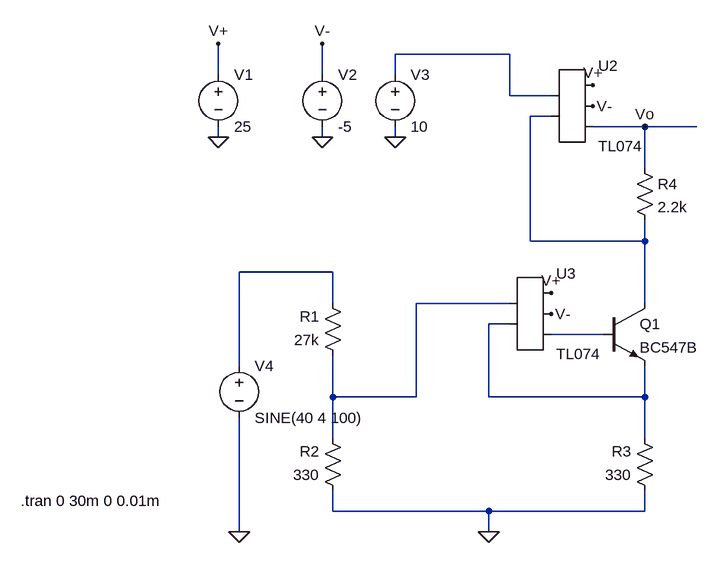
[diagram p0: schematic Actividad_Realimentacion.asc]
Actividad_Realimentacion.asc, the LTspice schematic file:
Version 4
SHEET 1 1040 680
WIRE 80 -96 -96 -96
WIRE -368 -64 -368 -112
WIRE -208 -64 -208 -112
WIRE -96 -64 -96 -96
WIRE 80 -32 80 -96
WIRE 144 -32 80 -32
WIRE 144 0 112 0
WIRE 288 16 208 16
WIRE 368 16 288 16
WIRE -368 32 -368 16
WIRE -208 32 -208 16
WIRE -96 32 -96 16
WIRE 288 80 288 16
WIRE 112 192 112 0
WIRE 288 192 288 160
WIRE 288 192 112 192
WIRE -192 240 -336 240
WIRE -192 288 -192 240
WIRE 80 288 -64 288
WIRE 288 288 288 192
WIRE 80 320 48 320
WIRE 224 336 144 336
WIRE -336 384 -336 240
WIRE -192 432 -192 368
WIRE -64 432 -64 288
WIRE -64 432 -192 432
WIRE 48 432 48 320
WIRE 288 432 288 384
WIRE 288 432 48 432
WIRE -192 496 -192 432
WIRE 288 496 288 432
WIRE -192 608 -192 576
WIRE 48 608 -192 608
WIRE 288 608 288 576
WIRE 288 608 48 608
WIRE -336 640 -336 464
WIRE 48 640 48 608
FLAG -368 32 0
FLAG -208 32 0
FLAG -368 -112 V+
FLAG -208 -112 V-
FLAG 144 304 V-
FLAG 144 272 V+
FLAG -96 32 0
FLAG 48 640 0
FLAG -336 640 0
FLAG 208 -48 V+
FLAG 208 -16 V-
FLAG 288 16 Vo
SYMBOL npn 224 288 R0
SYMATTR InstName Q1
SYMATTR Value BC547B
SYMBOL res -176 384 R180
WINDOW 0 36 76 Left 2
WINDOW 3 36 40 Left 2
SYMATTR InstName R1
SYMATTR Value 27k
SYMBOL res -176 592 R180
WINDOW 0 36 76 Left 2
WINDOW 3 36 40 Left 2
SYMATTR InstName R2
SYMATTR Value 330
SYMBOL voltage -368 -80 R0
WINDOW 123 0 0 Left 0
WINDOW 39 0 0 Left 0
SYMATTR InstName V1
SYMATTR Value 25
SYMBOL voltage -208 -80 R0
WINDOW 123 0 0 Left 0
WINDOW 39 0 0 Left 0
SYMATTR InstName V2
SYMATTR Value -5
SYMBOL AutoGenerated/TL074 112 304 R0
SYMATTR InstName U3
SYMBOL AutoGenerated/TL074 176 -16 R0
SYMATTR InstName U2
SYMBOL res 272 64 R0
SYMATTR InstName R4
SYMATTR Value 2.2k
SYMBOL voltage -96 -80 R0
WINDOW 123 0 0 Left 0
WINDOW 39 0 0 Left 0
SYMATTR InstName V3
SYMATTR Value 10
SYMBOL res 304 592 R180
WINDOW 0 36 76 Left 2
WINDOW 3 36 40 Left 2
SYMATTR InstName R3
SYMATTR Value 330
SYMBOL voltage -336 368 R0
WINDOW 123 0 0 Left 0
WINDOW 39 0 0 Left 0
SYMATTR InstName V4
SYMATTR Value SINE(40 4 100)
TEXT -672 592 Left 2 !.tran 0 30m 0 0.01m

The netlist it stands for:
* Actividad_Realimentacion.asc
Q1 N002 N006 N005 0 BC547B
R1 N004 N003 27k
R2 0 N004 330
V1 V+ 0 25
V2 V- 0 -5
* U3: TL074 (symbol AutoGenerated/TL074 not available, pins judged from their places): pin1=N004 pin2=N005 pin3=V+ pin4=V- pin5=N006
* U2: TL074 (symbol AutoGenerated/TL074 not available, pins judged from their places): pin1=N001 pin2=N002 pin3=V+ pin4=V- pin5=Vo
R4 Vo N002 2.2k
V3 N001 0 10
R3 0 N005 330
V4 N003 0 SINE(40 4 100)
.model NPN NPN
.model PNP PNP
.lib standard.bjt
.tran 0 30m 0 0.01m
.backanno
.end